# Altium project Expansion_Card.PrjPcb
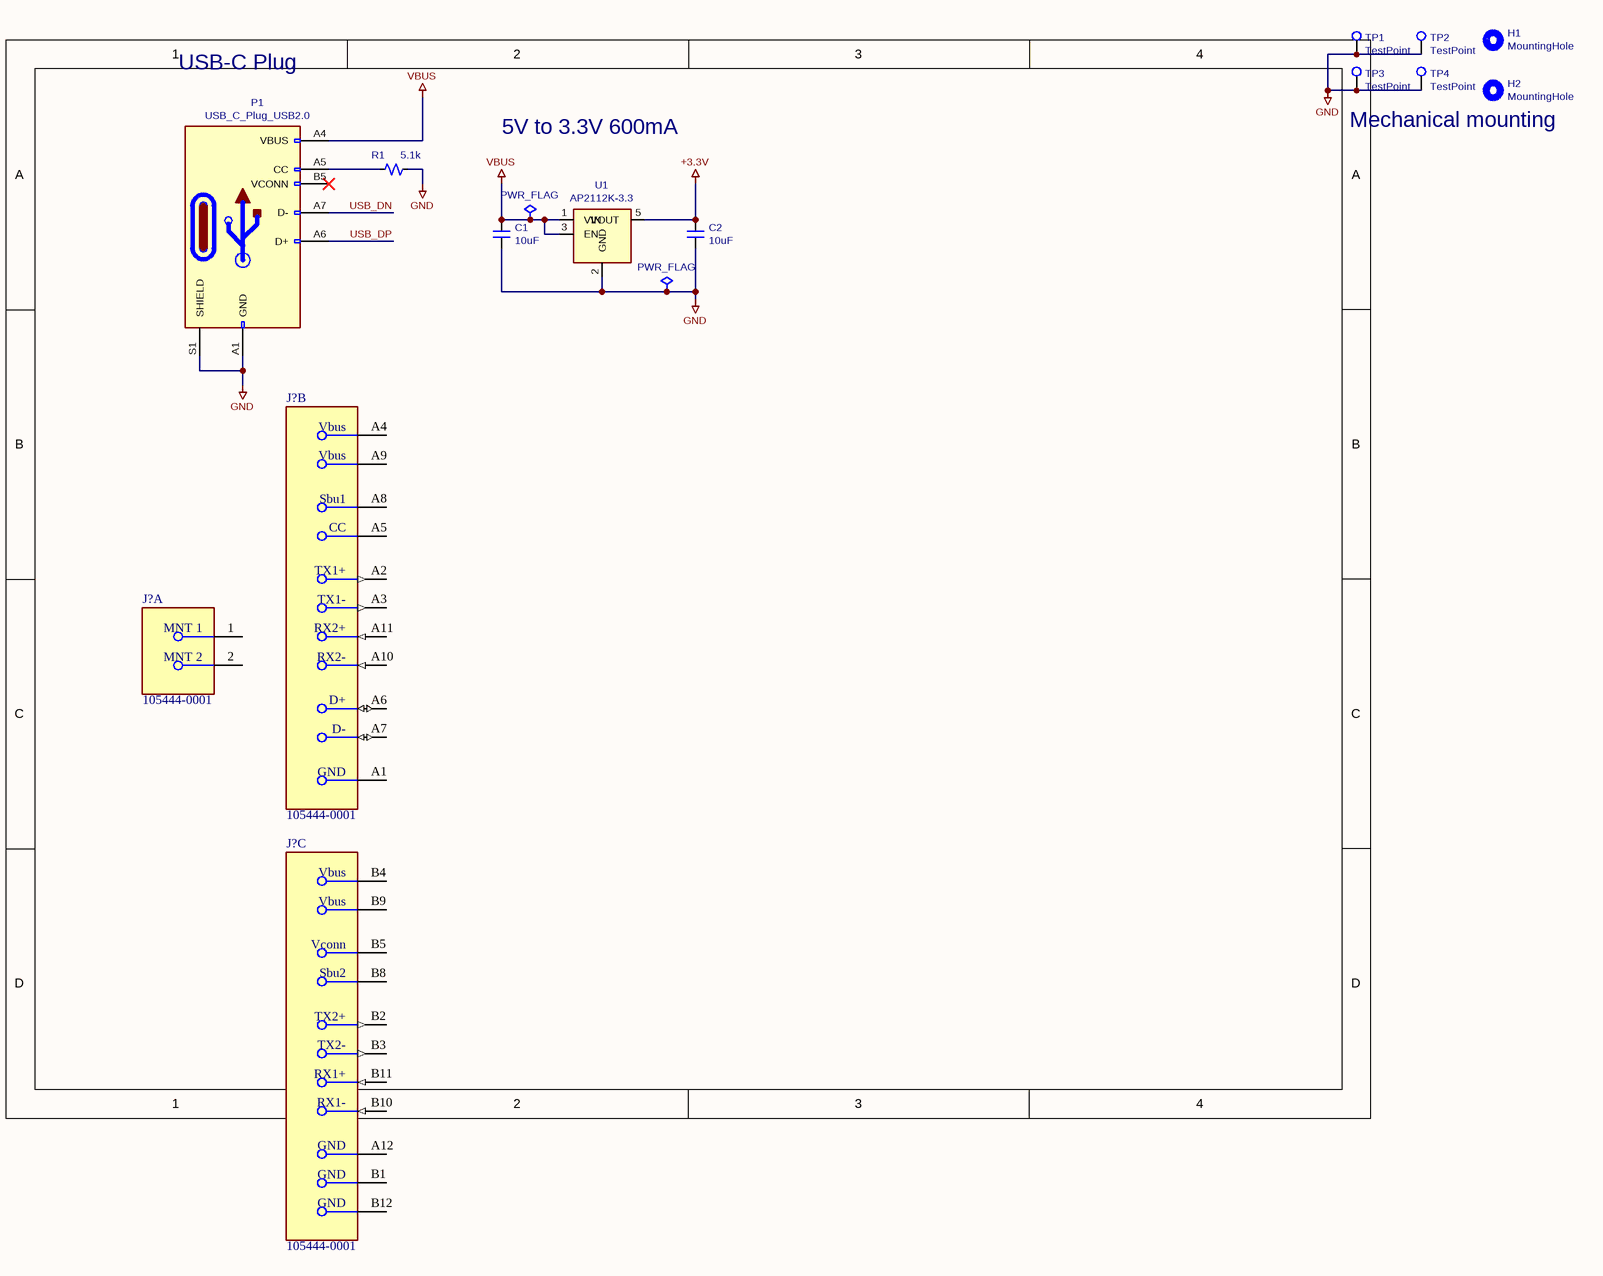
[diagram p0: Expansion_Card.SchDoc]
1 sheet, 16 parts. Net scope: global (net labels, ports and power ports of the same name join across sheets).
Board files: Expansion_Card.PcbDoc, Expansion_Card(1).PcbDoc

## Sheet Expansion_Card.SchDoc
size A

### Parts
(Parts that share a designator on the sheet are numbered #1, #2 ... from top to bottom, then left to right.)
#FLG01  PWR_FLAG  (graphical)
#FLG02  PWR_FLAG  (graphical)
C1  10uF  [C_0805_2012Metric]
C2  10uF  [C_0805_2012Metric]
H1  MountingHole  [MountingHole_2.2mm_M2]
H2  MountingHole  [MountingHole_2.2mm_M2]
J?#1  105444-0001  [FP-105444-0001-MFG]  (part B of 3)
J?#2  105444-0001  [FP-105444-0001-MFG]  (part A of 3)
J?#3  105444-0001  [FP-105444-0001-MFG]  (part C of 3)
P1  USB_C_Plug_USB2.0  [USB_C_Plug_Molex_105444]
R1  5.1k  [R_0603_1608Metric]
TP1  TestPoint  [TestPoint_Pad_1.5x1.5mm]
TP2  TestPoint  [TestPoint_Pad_1.5x1.5mm]
TP3  TestPoint  [TestPoint_Pad_1.5x1.5mm]
TP4  TestPoint  [TestPoint_Pad_1.5x1.5mm]
U1  AP2112K-3.3  [SOT-23-5]

### Nets
+3.3V: C2.1 U1.5(VOUT)
GND: #FLG02.1(pwr) C1.2 C2.2 P1.A1(GND) P1.S1(SHIELD) R1.2 TP1.1 TP2.1 TP3.1 TP4.1 U1.2(GND)
VBUS: #FLG01.1(pwr) C1.1 P1.A4(VBUS) U1.1(VIN) U1.3(EN)
USB_DN: P1.A7(D-)
USB_DP: P1.A6(D+)
NetP1_A5: P1.A5(CC) R1.1

Not connected (* = marked no-connect by the designer): J?#1 A1(GND) A2(TX1+) A3(TX1-) A4(Vbus) A5(CC) A6(D+) A7(D-) A8(Sbu1) A9(Vbus) A10(RX2-) A11(RX2+); J?#2 1(MNT_1) 2(MNT_2); J?#3 A12(GND) B1(GND) B2(TX2+) B3(TX2-) B4(Vbus) B5(Vconn) B8(Sbu2) B9(Vbus) B10(RX1-) B11(RX1+) B12(GND); P1 A9(VBUS) A12(GND) B1(GND) B4(VBUS) B5(VCONN)* B9(VBUS) B12(GND); U1 4(NC)

### Notes on the sheet
- USB-C Plug
- 5V to 3.3V 600mA
- (near H2) Mechanical mounting
- DWG. NO.
- REV.
- SHT.
- REVISION
- DESCRIPTION
- DATE
- APPROVED
- THIS DOCUMENT AND THE DATA DISCLOSED HEREIN OR HEREWITH IS THE PROPERTY OF ALTIUM LIMITED AND MAY BE FREELY DISTRIBUTED IN WHOLE. NO RIGHTS ARE RESERVED OR EXPRESS OR IMPLIED WARANTEE GIVEN.
- ENG:
- DSN:
- APPROVALS
- PROJECT
- DOCUMENT REVISION:
- DESIGN ITEM:
- CHK:
- BOM:
- REFERENCE DOCUMENTS
- PROJECT REVISION:
- TITLE
- FAB DWG:
- PCB DWG:
- ASSY DWG:
- SCALE:
- SIZE
- C
- CAGE CODE
- FILE NAME
- DWG NO.
- SHEET
- OF
- REV

### Library data of the parts
C1 C2 = C_Small: Value: 10uF; Footprint: Capacitor_SMD:C_0805_2012Metric
J?#1-J?#3 = CMP-002-00086-1: USB Connector; Connector Type: USB; Reach SVHC Compliant: Yes; RoHS Compliant: Yes
R1 = R_Small_US: Value: 5.1k; Footprint: Resistor_SMD:R_0603_1608Metric
#FLG01 #FLG02 = PWR_FLAG: Value: PWR_FLAG
H1 H2 = MountingHole: Value: MountingHole; Footprint: MountingHole:MountingHole_2.2mm_M2
P1 = USB_C_Plug_USB2.0: Value: USB_C_Plug_USB2.0; Footprint: Expansion_Card:USB_C_Plug_Molex_105444
TP1-TP4 = TestPoint: Value: TestPoint; Footprint: TestPoint:TestPoint_Pad_1.5x1.5mm
U1 = AP2112K-3.3: Value: AP2112K-3.3; Footprint: Package_TO_SOT_SMD:SOT-23-5